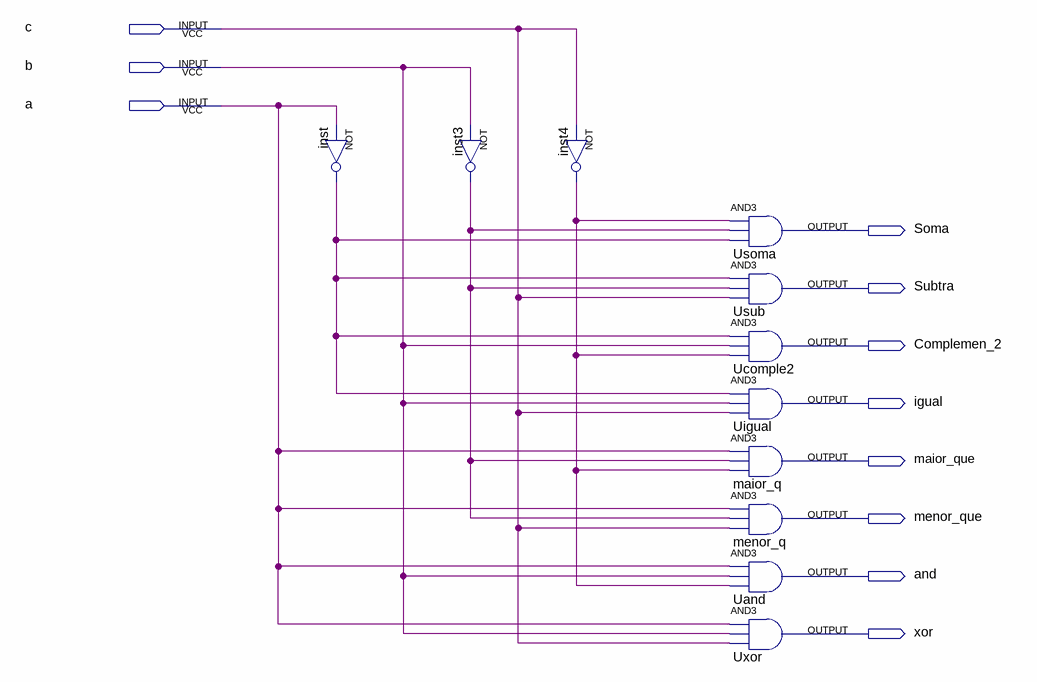
[diagram p0: schematic sheet]
// Quartus schematic sistema.bdf as structural Verilog: 11 symbols, 11 pins
module sistema (
  input  c,
  input  b,
  input  a,
  output Soma,
  output Subtra,
  output Complemen_2,
  output igual,
  output maior_que,
  output menor_que,
  output \and ,
  output \xor 
);

  wire inst3_out, inst4_out, inst_out;

  not inst (inst_out, a);
  not inst3 (inst3_out, b);
  not inst4 (inst4_out, c);
  and Usoma (Soma, inst4_out, inst3_out, inst_out);
  and Usub (Subtra, inst_out, inst3_out, c);
  and Ucomple2 (Complemen_2, inst_out, b, inst4_out);
  and Uigual (igual, inst_out, b, c);
  and maior_q (maior_que, a, inst3_out, inst4_out);
  and menor_q (menor_que, a, inst3_out, c);
  and Uand (\and , a, b, inst4_out);
  and Uxor (\xor , a, b, c);
endmodule
